# EAGLE design PROYEK (EAGLE 9.6.2)
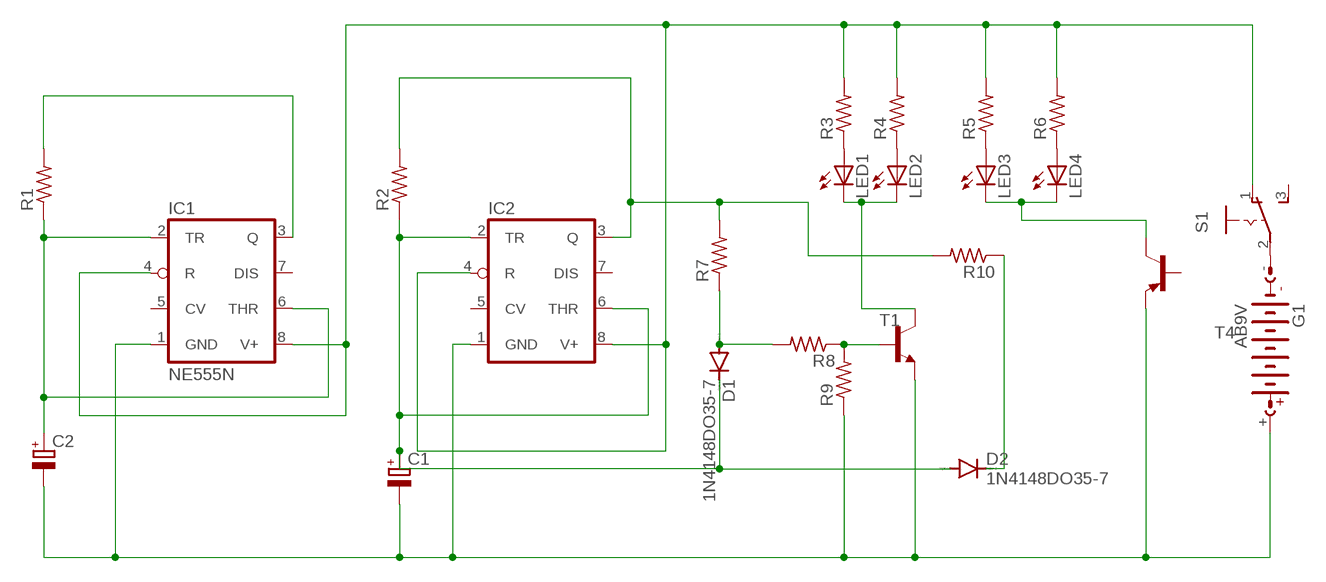
[diagram p0: schematic, sheet 1]

## Parts
C1  CPOL-EUE3.5-8  [E3,5-8]
C2  CPOL-EUE3.5-10  [E3,5-10]
D1  1N4148DO35-7  [DO35-7]
D2  1N4148DO35-7  [DO35-7]
G1  AB9V  [AB9V]
IC1  NE555N  [DIL08]
IC2  NE555N  [DIL08]
LED1  LED5MM  [LED5MM]
LED2  LED5MM  [LED5MM]
LED3  LED5MM  [LED5MM]
LED4  LED5MM  [LED5MM]
R1  R-US_0204/2V  [0204V]
R2  R-US_0204/2V  [0204V]
R3  R-US_0204/7  [0204/7]
R4  R-US_0204/7  [0204/7]
R5  R-US_0204/7  [0204/7]
R6  R-US_0204/7  [0204/7]
R7  R-US_0204/7  [0204/7]
R8  R-US_0204/7  [0204/7]
R9  R-US_0204/7  [0204/7]
R10  R-US_0204/7  [0204/7]
S1  255SB  [255SB]
T1  BC547-NPN-TO92-CBE  [TO92-CBE]
T4  BC557C-PNP-TO92-EBC  [TO92-EBC]

## Nets
N$1: LED1.A R3.1
N$2: LED2.A R4.1
N$3: LED3.A R5.1
N$4: LED4.A R6.1
N$5: G1.- S1.2(P)
N$6: IC2.3(Q) R2.2 R7.2 R10.2
N$7: C1.- C2.- G1.+ IC1.1(GND) IC2.1(GND) R9.1 T1.E T4.E
N$8: C2.+ IC1.2(TR) IC1.6(THR) R1.1
N$9: IC1.4(R) IC1.8(V+) IC2.4(R) IC2.8(V+) R3.2 R4.2 R5.2 R6.2 S1.1(O)
N$10: IC1.3(Q) R1.2
N$11: C1.+ D1.C D2.A IC2.2(TR) IC2.6(THR) R2.1
N$12: D1.A R7.1 R8.2
N$13: R8.1 R9.2 T1.B
N$14: LED1.K(C) LED2.K(C) T1.C
N$15: LED3.K(C) LED4.K(C) T4.C
N$16: D2.C R10.1
Unconnected: IC1.5(CV) IC1.7(DIS) IC2.5(CV) IC2.7(DIS) S1.3(S) T4.B

## Library data of the parts
C1 C2 = rcl:CPOL-EU: POLARIZED CAPACITOR, European symbol; SPICEPREFIX: C
D1 D2 = diode:1N4148: DIODE high speed (Philips)
G1 = battery:AB9V: 9-V BATTERY CLIP
IC1 IC2 = linear:*555: TIMER
LED1-LED4 = led:LED: LED OSRAM: - CHIPLED LG R971, LG N971, LY N971, LG Q971, LY Q971, LO R971, LY R971 LH N974, LH R974 LS Q976, LO Q976, LY Q976 LO Q996 - Hyper CHIPLED LW Q18S LB Q993, LB Q99A, LB R99A - SideLED LS A670, LO A670, LY A670, LG A670, LP A670 LB A673, LV A673, LT A673, LW A673 LH A674 LY A675 LS A676, LA A676, LO A676, LY A676, LW A676 LS A679, LY A679, LG A679 - Hyper Micro SIDELED® LS Y876, LA Y876, LO Y876, LY Y876 LT Y87S - SmartLED LW L88C, LW L88S LB L89C, LB L89S, LG L890 LS L89K, LO L89K, LY L89K LS L896, LA L896, LO L896, LY L896 - TOPLED LS T670, LO T670, LY T670, LG T670, LP T670 LSG T670, LSP T670, LSY T670, LOP T670, LYG T670 LG T671, LOG T671, LSG T671 LB T673, LV T673, LT T673, LW T673 LH T674 LS T676, LA T676, LO T676, LY T676, LB T676, LH T676, LSB T676, LW T676 LB T67C, LV T67C, LT T67C, LS T67K, LO T67K, LY T67K, LW E67C LS E67B, LA E67B, LO E67B, LY E67B, LB E67C, LV E67C, LT E67C LW T67C LS T679, LY T679, LG T679 LS T770, LO T770, LY T770, LG T770, LP T770 LB T773, LV T773, LT T773, LW T773 LH T774 LS E675, LA E675, LY E675, LS T675 LS T776, LA T776, LO T776, LY T776, LB T776 LHGB T686 LT T68C, LB T68C - Hyper Mini TOPLED® LB M676 - Mini TOPLED Santana® LG M470 LS M47K, LO M47K, LY M47K Source: http://www.osram.convergy.de LUXEON: - LUMILED® LXK2-PW12-R00, LXK2-PW12-S00, LXK2-PW14-U00, LXK2-PW14-V00 LXK2-PM12-R00, LXK2-PM12-S00, LXK2-PM14-U00 LXK2-PE12-Q00, LXK2-PE12-R00, LXK2-PE12-S00, LXK2-PE14-T00, LXK2-PE14-U00 LXK2-PB12-K00, LXK2-PB12-L00, LXK2-PB12-M00, LXK2-PB14-N00, LXK2-PB14-P00, LXK2-PB14-Q00 LXK2-PR12-L00, LXK2-PR12-M00, LXK2-PR14-Q00, LXK2-PR14-R00 LXK2-PD12-Q00, LXK2-PD12-R00, LXK2-PD12-S00 LXK2-PH12-R00, LXK2-PH12-S00 LXK2-PL12-P00, LXK2-PL12-Q00, LXK2-PL12-R00 Source: www.luxeon.com KINGBRIGHT: KA-3528ASYC Source: www.kingbright.com
R1-R10 = rcl:R-US_: RESISTOR, American symbol; SPICEPREFIX: R
S1 = switch:255SB: SLIDING SWITCH Distributor Buerklin, 11G810
T1 = transistor:*-NPN-: NPN Transistror BF959 corrected 2008.03.06
T4 = transistor:*-PNP-: PNP Transistror

## Board
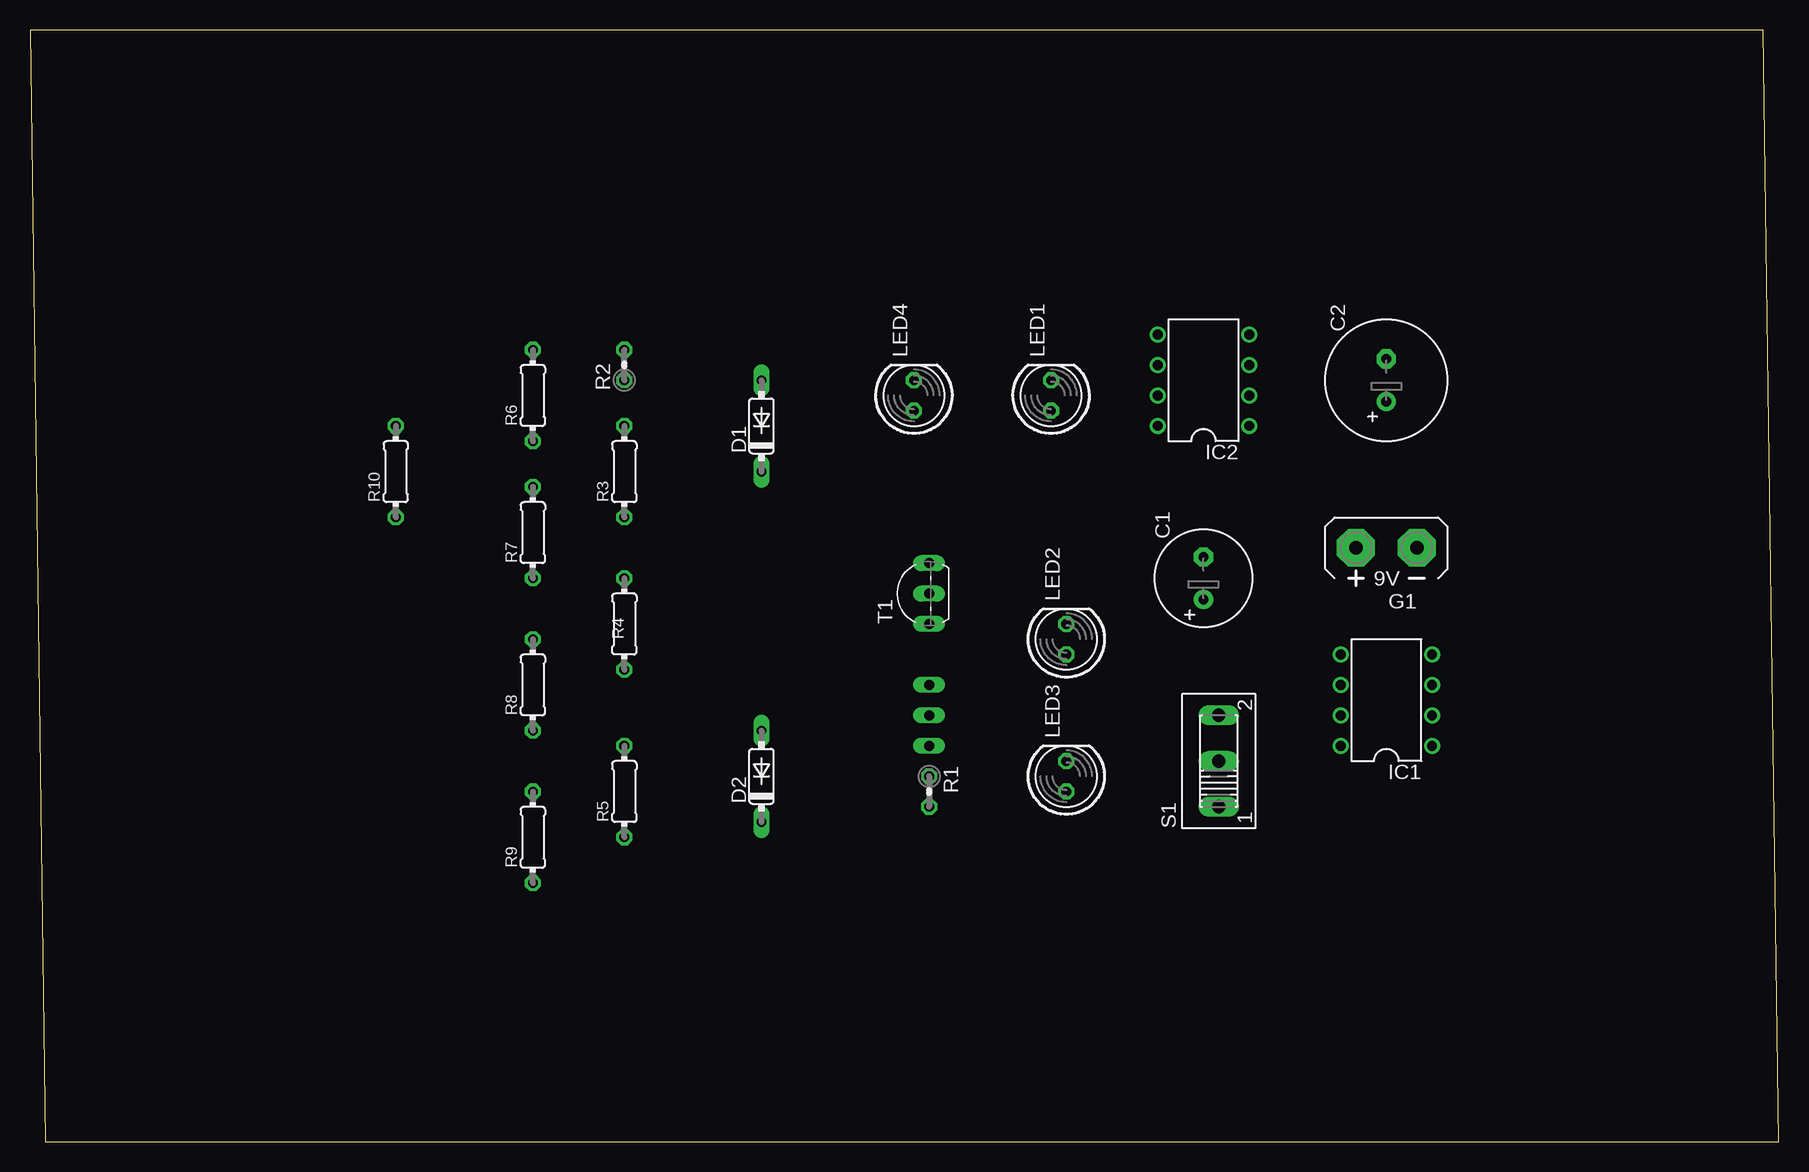
[diagram p1: board, top side]
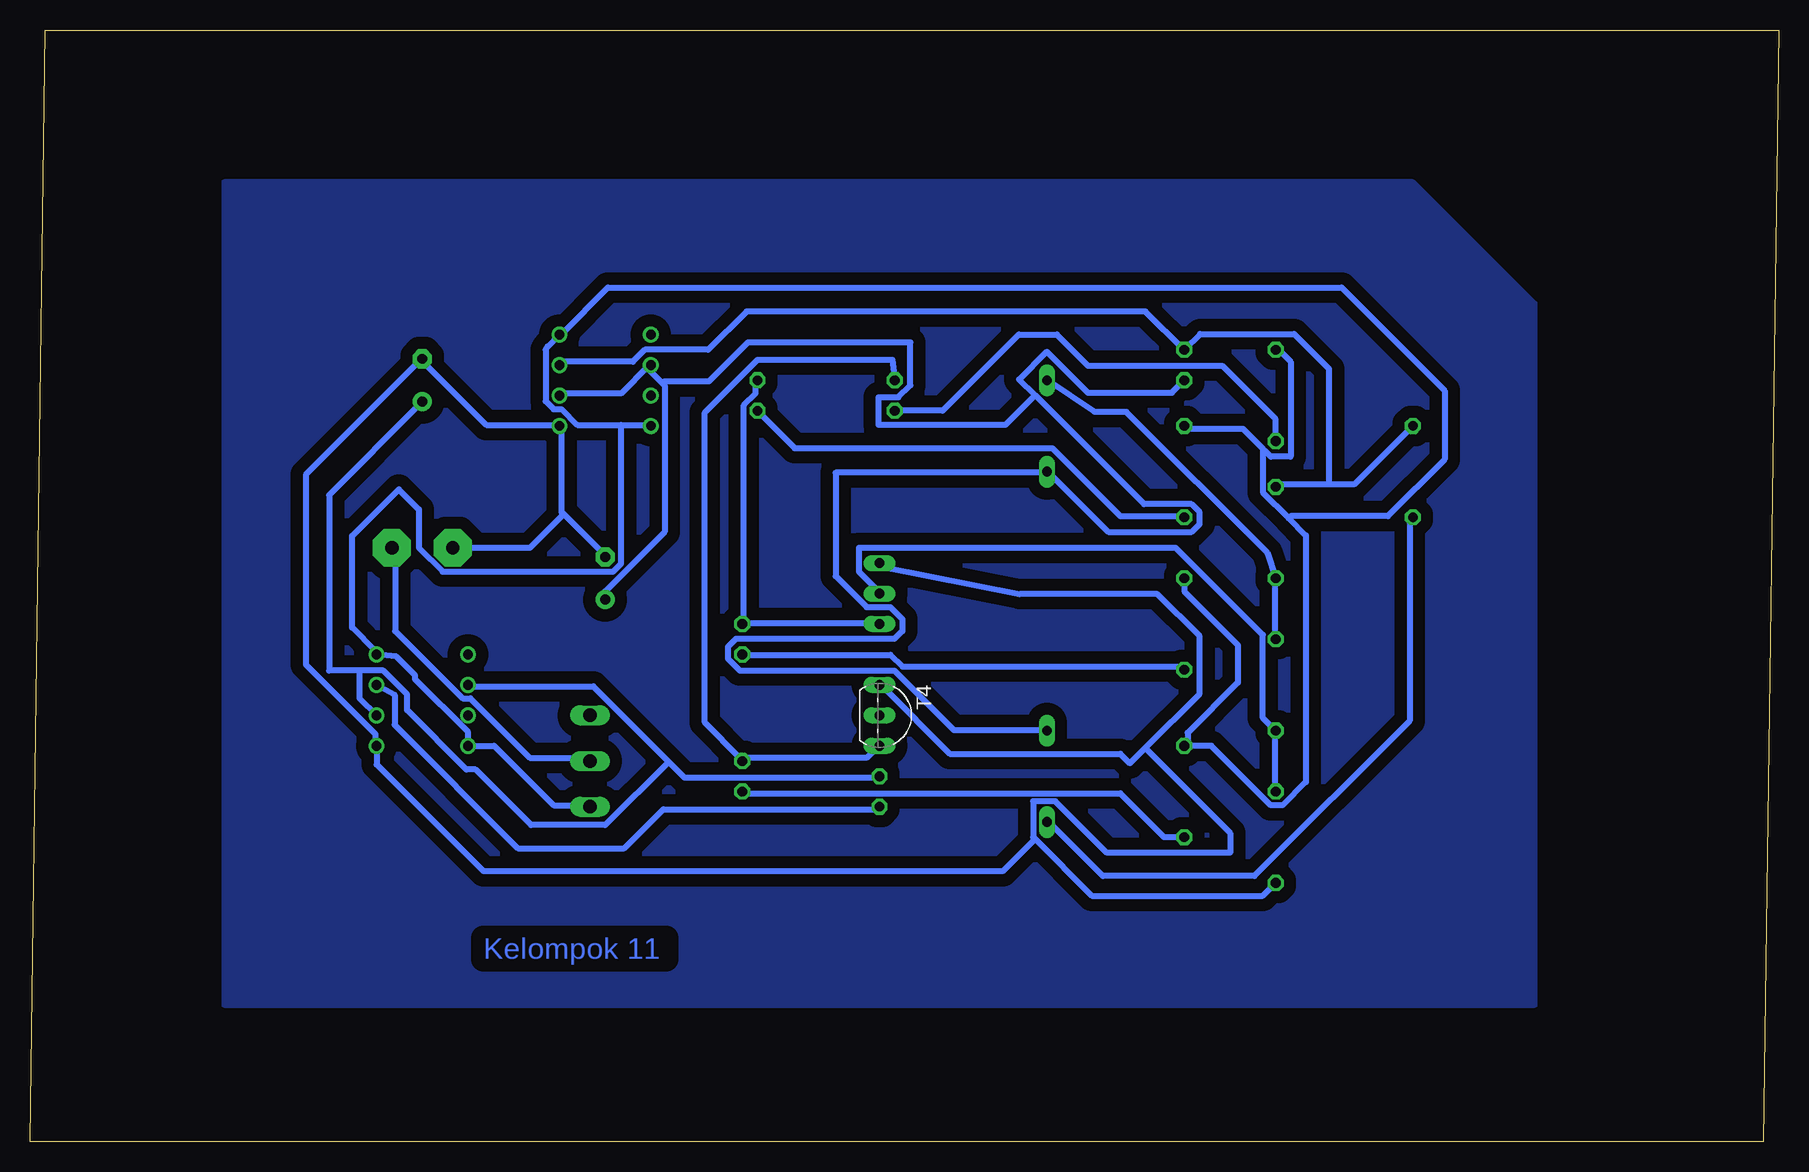
[diagram p2: board, bottom side, seen from below]

Size 145.72 x 92.7 mm. Coordinates in mm from the lower left corner, seen from the top.
Outline: 1.27,0 145.72,0 144.45,92.7 0,92.7 1.27,0
Copper layers (1*16): Top 0.035mm / dielectric 1.5mm / Bottom 0.035mm
Design rules "default *": minimum track width 20mil, minimum drill 0.35mm, track to track 6mil, track to pad 6mil, pad to pad 6mil, via to via 6mil, smd to smd 6mil, copper to edge 40mil, drill to drill 6mil, minimum pad ring 10mil, minimum via ring 8mil, stop-mask expansion 4mil, vias tented up to drill 0mil, thermal gap 10mil

### Footprints (pad centres in the part's own frame; a part is rotated, then mirrored left to right if it is on the bottom)
E3,5-8 = drill 0.813 pad 1.6: + -1.778,0 | drill 0.813 pad 1.6 octagon: - 1.778,0
E3,5-10 = drill 0.813 pad 1.6: + -1.778,0 | drill 0.813 pad 1.6 octagon: - 1.778,0
DO35-7 = drill 0.813 long: A 3.81,0; C -3.81,0
AB9V = drill 1.118 pad 3.15 octagon: + 0,2.54; - 0,-2.54
DIL08 = drill 0.813 pad 1.27: 1 -3.81,-3.81; 2 -1.27,-3.81; 3 1.27,-3.81; 4 3.81,-3.81; 5 3.81,3.81; 6 1.27,3.81; 7 -1.27,3.81; 8 -3.81,3.81
LED5MM = drill 0.813 octagon: A -1.27,0; K 1.27,0
0204V = drill 0.813 octagon: 1 -1.27,0; 2 1.27,0
0204/7 = drill 0.813 octagon: 1 -3.81,0; 2 3.81,0
255SB = drill 1.118 long: 1 -3.81,0; 2 0,0; 3 3.81,0
TO92-CBE = drill 0.813 long: B 0,0; C -2.54,0; E 2.54,0
TO92-EBC = drill 0.813 long: B 0,-1.27; C 2.54,-1.27; E -2.54,-1.27

### Placement (x,y rotation side)
C1  97.79,46.99 90 top
C2  113.03,63.5 90 top
D1  60.96,59.69 90 top
D2  60.96,30.48 90 top
G1  113.03,49.53 90 top
IC1  113.03,36.83 90 top
IC2  97.79,63.5 90 top
LED1  85.09,62.23 90 top
LED2  86.36,41.91 90 top
LED3  86.36,30.48 90 top
LED4  73.66,62.23 90 top
R1  74.93,29.21 270 top
R2  49.53,64.77 90 top
R3  49.53,55.88 90 top
R4  49.53,43.18 90 top
R5  49.53,29.21 90 top
R6  41.91,62.23 90 top
R7  41.91,50.8 90 top
R8  41.91,38.1 90 top
R9  41.91,25.4 90 top
R10  30.48,55.88 90 top
S1  99.06,31.75 90 top
T1  74.93,45.72 90 top
T4  73.66,35.56 270 bottom

### Tracks (layer width: path | path; a pad name or v marks a point on that pad's centre or on a via)
KELOMPOK11
  pour Bottom (isolate 1.016): 30.48,80.01 129.54,80.01 129.54,11.43 20.32,11.43 20.32,69.85
N$1
  Bottom 0.508: R3.1 49.58,52.17 54.86,52.17 60.53,57.84 81.99,57.84 84.91,60.76 LED1.A
N$2
  Bottom 0.508: R4.1 49.58,39.62 73.03,39.62 74.02,40.62 86.23,40.62 LED2.A
N$3
  Bottom 0.508: LED3.A 86.21,29.06 54.86,29.06 51.23,25.43 49.58,25.43 R5.1
N$4
  Bottom 0.508: R6.1 41.91,60.25 46.38,64.72 57.56,64.72 60.15,67.31 63.32,67.31 69.67,60.96 LED4.A
N$5
  Bottom 0.508: S1.2 99.11,32.03 104.06,32.03 109.02,36.98 109.68,36.98 115.29,42.6 115.29,49.53 G1.-
N$6
  Bottom 0.508: 37.47,54.81 35.38,54.81 30.76,59.44 R10.2 | 37.47,54.81 41.66,54.81 R7.2 | 37.47,54.81 37.47,64.44 40.39,67.36 48.21,67.36 R2.2 49.58,66.04 52.78,69.24 86,69.24 89.2,66.04 94.49,66.04 95.48,65.05 101.42,65.05 IC2.3
N$7
  Bottom 0.508: 101.26,52.34 97.79,48.87 C1.- | 101.26,52.34 101.42,52.5 101.42,59.44 IC2.1 101.75,59.77 107.7,59.77 112.98,65.05 C2.- 113.31,65.05 122.73,55.63 122.73,39.8 116.94,34.01 116.94,33.02 IC1.1 116.84,31.47 107.92,22.55 64.67,22.55 61.96,25.26 | 101.26,52.34 104.06,49.53 G1.+ | R9.1 42.98,20.52 57.23,20.52 61.96,25.26 | 61.96,25.26 62.13,25.43 62.13,28.4 60.27,28.4 55.98,24.11 45.72,24.11 45.72,25.76 52.79,32.83 | T4.E 74.68,37.97 69.06,32.36 54.86,32.36 54.06,31.56 52.79,32.83 | 52.79,32.83 48.26,37.36 48.26,42.16 51.77,45.67 63.25,45.67 74.61,47.94 T1.E
N$8
  Bottom 0.508: IC1.2 118.26,36.98 118.26,39.29 | C2.+ 113.31,61.42 120.8,53.92 120.8,39.29 118.26,39.29 | 92.51,31.7 98.78,37.97 109.02,37.97 IC1.6 | 92.51,31.7 91.19,30.38 75.01,30.38 R1.1 | 118.26,39.29 116.28,39.29 114.3,37.31 114.3,35.99 109.35,31.04 108.58,31.04 103.96,26.42 97.79,26.42 92.51,31.7
N$9
  Bottom 0.508: 49.25,33.02 49.25,34.11 45.06,38.3 45.06,41.43 49.53,45.9 R4.2 | R3.2 49.25,59.44 44.63,59.44 42.98,57.78 42.98,57.45 | R6.2 41.66,66.04 40.66,65.05 40.66,57.12 42.32,57.12 42.81,57.62 42.98,57.45 | 49.25,33.02 47.27,33.02 42.32,28.07 41.33,28.07 39.39,30 39.39,50.57 40.83,52.01 | 40.83,52.01 42.98,54.15 42.98,57.45 | 49.25,33.02 R5.2 | 96.47,59.77 100.1,59.77 101.42,61.09 102.08,61.09 102.74,61.75 102.74,66.04 102.59,66.32 IC2.4 101.42,67.36 97.56,71.22 36.42,71.22 27.84,62.64 27.84,56.9 32.56,52.17 40.66,52.17 40.83,52.01 | 96.47,59.77 94.16,59.77 IC2.8 | S1.1 99.11,28.07 102.08,28.07 107.04,33.02 IC1.8 109.22,34.16 113.64,38.58 113.64,38.91 115.18,40.46 IC1.4 116.94,40.95 118.87,42.88 118.87,50.52 114.99,54.41 113.31,52.73 113.31,49.53 111.33,47.55 97.13,47.55 96.47,48.21 96.47,59.77
N$10
  Bottom 0.508: R1.2 75.01,27.74 92.94,27.74 96.19,24.49 105.05,24.49 115.34,34.77 115.34,37.27 IC1.3
N$11
  Bottom 0.508: IC2.2 101.42,62.41 96.47,62.41 94.16,64.72 IC2.6 94.16,64.39 93,63.23 | C1.+ 97.79,45.9 92.84,50.85 92.84,63.07 93,63.23 | R2.1 50.57,62.46 57.56,62.46 60.97,65.88 63.28,63.56 61.96,62.24 | 61.96,62.24 52.88,53.16 48.92,53.16 48.26,52.5 48.26,51.51 48.92,50.85 55.86,50.85 60.81,55.8 D1.C 61.14,55.8 78.59,55.8 78.59,47.17 76,44.58 74.02,44.58 73.03,43.59 73.03,42.6 73.69,41.94 86.89,41.94 87.55,41.27 87.55,40.28 86.56,39.29 73.69,39.29 68.73,34.34 61.14,34.34 D2.A | 61.96,62.24 64.44,59.77 75.01,59.77 75.01,62.08 73.35,62.08 72.37,63.07 72.37,66.65 85.9,66.65 89.15,63.4 92.84,63.4 93,63.23
N$12
  Bottom 0.508: R8.2 41.99,41.94 41.99,46.89 R7.1 42.62,49.12 54.36,60.86 57,60.86 D1.A
N$13
  Bottom 0.508: R9.2 41.99,29.39 41.99,34.01 R8.1 41.99,34.34 42.98,35.33 42.98,42.27 50.24,49.53 76.66,49.53 76.66,47.55 75.01,45.9 T1.B
N$14
  Bottom 0.508: 86.23,43.26 75.01,43.26 T1.C | 86.23,43.26 86.23,61.42 85.24,62.41 85.24,63.4 LED1.K | 86.23,43.26 LED2.K
N$15
  Bottom 0.508: T4.C 75.01,33.02 76,32.03 86.23,32.03 LED3.K 86.56,32.03 89.48,34.95 89.48,60.81 85.08,65.22 73.85,65.22 LED4.K
N$16
  Bottom 0.508: D2.C 60.81,26.42 60.55,26.42 56.31,22.17 43.69,22.17 30.76,35.1 30.76,51.84 R10.1
N$17  (via drill 0.35)
  other vias: 41.91,41.91
N$18  (via drill 0.35)
  other vias: 74.93,33.02
N$19  (via drill 0.35)
  other vias: 74.93,35.56
N$20  (via drill 0.35)
  other vias: 49.53,39.37
N$21  (via drill 0.35)
  other vias: 60.96,34.29
N$22  (via drill 0.35)
  other vias: 49.53,33.02
N$23  (via drill 0.35)
  other vias: 30.48,52.07
N$24  (via drill 0.35)
  other vias: 49.53,52.07
N$25  (via drill 0.35)
  other vias: 49.53,46.99
N$26  (via drill 0.35)
  other vias: 41.91,46.99
N$27  (via drill 0.35)
  other vias: 60.96,55.88
N$28  (via drill 0.35)
  other vias: 30.48,59.69
N$29  (via drill 0.35)
  other vias: 41.91,54.61
N$30  (via drill 0.35)
  other vias: 49.53,25.4
N$31  (via drill 0.35)
  other vias: 41.91,29.21
N$32  (via drill 0.35)
  other vias: 41.91,34.29
N$33  (via drill 0.35)
  other vias: 74.93,27.94
N$34  (via drill 0.35)
  other vias: 41.91,58.42
N$35  (via drill 0.35)
  other vias: 74.93,30.48
N$36  (via drill 0.35)
  other vias: 60.96,26.67
N$37  (via drill 0.35)
  other vias: 41.91,21.59
N$38  (via drill 0.35)
  other vias: 60.96,63.5
N$39  (via drill 0.35)
  other vias: 93.98,59.69
N$40  (via drill 0.35)
  other vias: 85.09,60.96
N$41  (via drill 0.35)
  other vias: 86.36,29.21
N$42  (via drill 0.35)
  other vias: 99.06,35.56
N$43  (via drill 0.35)
  other vias: 74.93,48.26
N$44  (via drill 0.35)
  other vias: 73.66,60.96
N$45  (via drill 0.35)
  other vias: 49.53,63.5
N$46  (via drill 0.35)
  other vias: 49.53,66.04
N$47  (via drill 0.35)
  other vias: 74.93,38.1
N$48  (via drill 0.35)
  other vias: 49.53,59.69
N$49  (via drill 0.35)
  other vias: 74.93,43.18
N$50  (via drill 0.35)
  other vias: 74.93,45.72
N$51  (via drill 0.35)
  other vias: 116.84,33.02
N$52  (via drill 0.35)
  other vias: 93.98,62.23
N$53  (via drill 0.35)
  other vias: 73.66,63.5
N$54  (via drill 0.35)
  other vias: 41.91,66.04
N$55  (via drill 0.35)
  other vias: 101.6,59.69
N$56  (via drill 0.35)
  other vias: 109.22,33.02
N$57  (via drill 0.35)
  other vias: 86.36,31.75
N$58  (via drill 0.35)
  other vias: 99.06,31.75
N$59  (via drill 0.35)
  other vias: 116.84,40.64
N$60  (via drill 0.35)
  other vias: 116.84,38.1
N$61  (via drill 0.35)
  other vias: 116.84,35.56
N$63  (via drill 0.35)
  other vias: 115.57,49.53
N$64  (via drill 0.35)
  other vias: 109.22,40.64
N$65  (via drill 0.35)
  other vias: 109.22,35.56
N$66  (via drill 0.35)
  other vias: 99.06,27.94
N$67  (via drill 0.35)
  other vias: 85.09,63.5
N$68  (via drill 0.35)
  other vias: 101.6,64.77
N$69  (via drill 0.35)
  other vias: 101.6,67.31
N$70  (via drill 0.35)
  other vias: 101.6,62.23
N$71  (via drill 0.35)
  other vias: 109.22,38.1
N$72  (via drill 0.35)
  other vias: 93.98,64.77
N$73  (via drill 0.35)
  other vias: 86.36,43.18
N$74  (via drill 0.35)
  other vias: 86.36,40.64
N$76  (via drill 0.35)
  other vias: 93.98,67.31

### Text on the board
Bottom: Kelompok 11